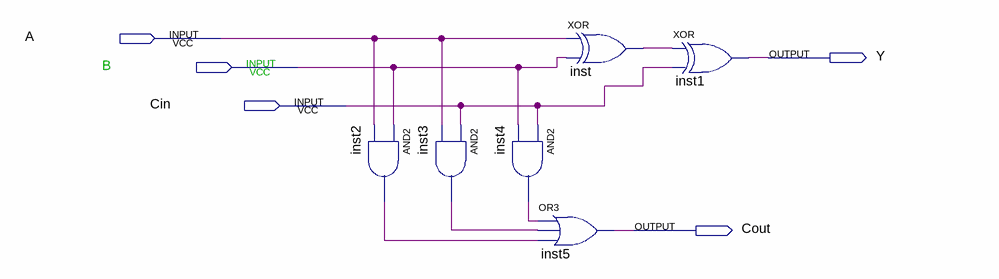
[diagram p0: schematic sheet]
// Quartus schematic 1bit_adder.bdf as structural Verilog: 6 symbols, 5 pins
module \1bit_adder  (
  input  A,
  input  B,
  input  Cin,
  output Y,
  output Cout
);

  wire inst2_out, inst3_out, inst4_out, inst_out;

  and inst2 (inst2_out, B, A);
  and inst3 (inst3_out, Cin, A);
  and inst4 (inst4_out, Cin, B);
  xor inst (inst_out, A, B);
  or inst5 (Cout, inst4_out, inst3_out, inst2_out);
  xor inst1 (Y, inst_out, Cin);
endmodule
